# EAGLE design ADS1232 (EAGLE 9.5.2)
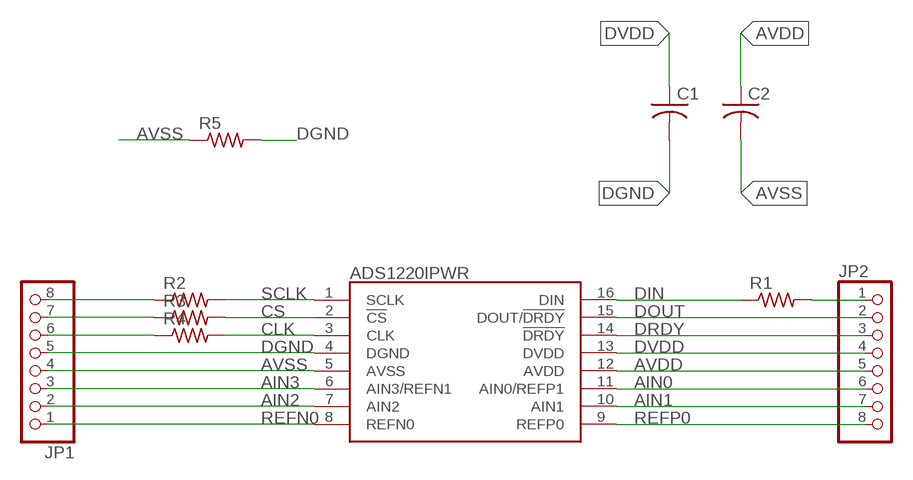
[diagram p0: schematic, sheet 1]

## Parts
C1  C-USC0805K  [C0805K]
C2  C-USC0805K  [C0805K]
IC1  ADS1220IPWR  [SOP65P640X120-16N]
JP1  PINHD-1X8  [1X08]
JP2  PINHD-1X8  [1X08]
R1  R-US_M2012  [M2012]
R2  R-US_M2012  [M2012]
R3  R-US_M2012  [M2012]
R4  R-US_M2012  [M2012]
R5  R-US_M2012  [M2012]

## Nets
AIN0: IC1.11(AIN0/REFP1) JP2.6
AIN1: IC1.10(AIN1) JP2.7
AIN2: IC1.7(AIN2) JP1.2
AIN3: IC1.6(AIN3/REFN1) JP1.3
AVDD: C2.1 IC1.12(AVDD) JP2.5
AVSS: C2.2 IC1.5(AVSS) JP1.4 R5.1
CLK: IC1.3(CLK) R4.2
CS: IC1.2(!CS) R3.2
DGND: C1.2 IC1.4(DGND) JP1.5 R5.2
DIN: IC1.16(DIN) R1.1
DOUT: IC1.15(DOUT/!DRDY) JP2.2
DRDY: IC1.14(!DRDY) JP2.3
DVDD: C1.1 IC1.13(DVDD) JP2.4
N$2: JP1.8 R2.1
N$3: JP1.7 R3.1
N$6: JP1.6 R4.1
N$20: JP2.1 R1.2
REFN0: IC1.8(REFN0) JP1.1
REFP0: IC1.9(REFP0) JP2.8
SCLK: IC1.1(SCLK) R2.2

## Library data of the parts
C1 C2 = adafruit:C-US: CAPACITOR, American symbol
IC1 = ADS1220IPWR:ADS1220IPWR: 24-bit, 2-kSPS, 4-ch, low-power, small-size delta-sigma ADC w/ PGA, VREF, 2x IDACs & SPI interface Source: Datasheet <https://www.ti.com/lit/gpn/ADS1220>; DESCRIPTION: 24-bit, 2-kSPS, 4-ch, low-power, small-size delta-sigma ADC w/ PGA, VREF, 2x IDACs & SPI interface; HEIGHT: 1.2mm; MANUFACTURER_NAME: Texas Instruments; MANUFACTURER_PART_NUMBER: ADS1220IPWR; TEXAS_INSTRUMENTS_PART_NUMBER: ADS1220IPWR; TEXAS_INSTRUMENTS_PRICE-STOCK: https://www.ti.com/store/ti/en/p/product/?p=ADS1220IPWR
JP1 JP2 = pinhead:PINHD-1X8: PIN HEADER
R1-R5 = adafruit:R-US_: RESISTOR, American symbol

## Board
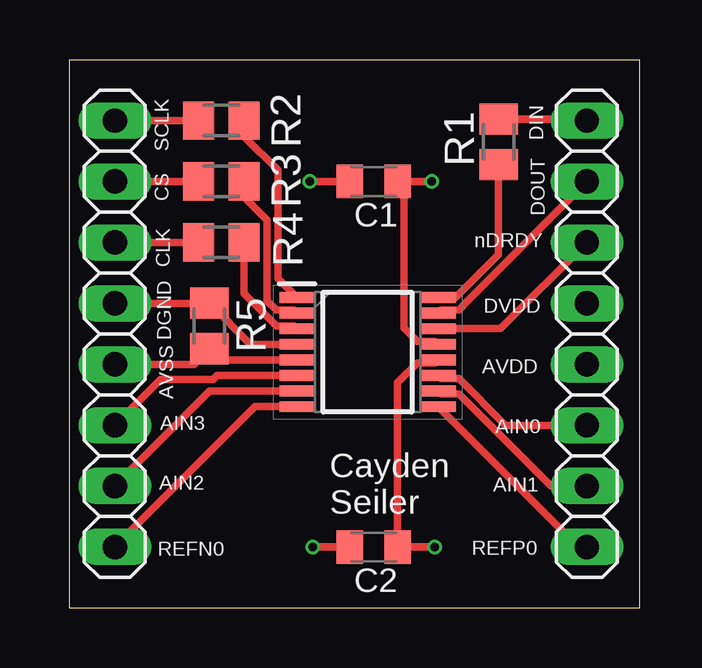
[diagram p1: board, top side]
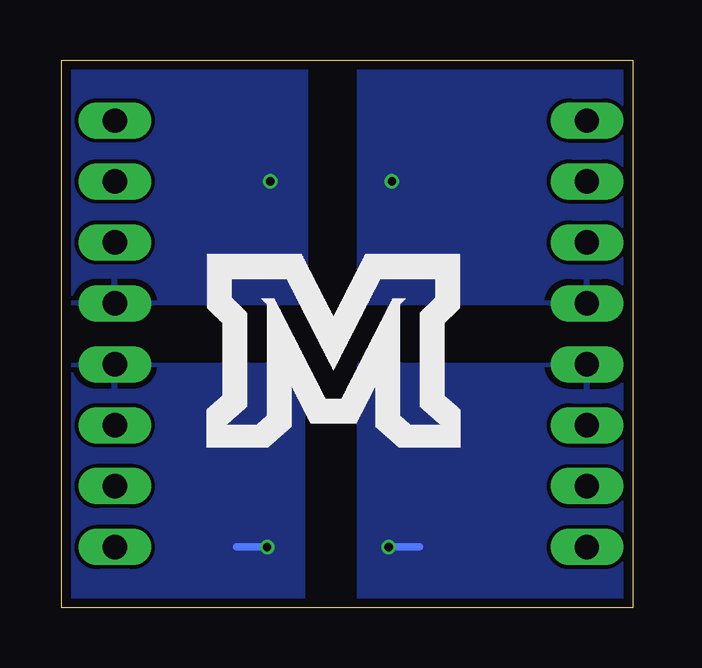
[diagram p2: board, bottom side, seen from below]

Size 23.8 x 22.85 mm. Coordinates in mm from the lower left corner, seen from the top.
Outline: 0,0 23.8,0 23.8,22.85 0,22.85 0,0
Copper layers (1*16): Top 0.035559375mm / dielectric 1.6mm / Bottom 0.035559375mm
Design rules "oshpark2layer": minimum track width 6mil, minimum drill 10mil, track to track 6mil, track to pad 6mil, pad to pad 6mil, via to via 6mil, smd to smd 6mil, copper to edge 15mil, drill to drill 6mil, minimum pad ring 5mil, minimum via ring 5mil, stop-mask expansion 2.5mil, vias tented up to drill 0mil, thermal gap 10mil

### Footprints (pad centres in the part's own frame; a part is rotated, then mirrored left to right if it is on the bottom)
C0805K = smd 1.1 x 1.4: 1 -1,0; 2 1,0
SOP65P640X120-16N = smd 1.475 x 0.45: 1 -2.938,2.275; 2 -2.938,1.625; 3 -2.938,0.975; 4 -2.938,0.325; 5 -2.938,-0.325; 6 -2.938,-0.975; 7 -2.938,-1.625; 8 -2.938,-2.275; 9 2.938,-2.275; 10 2.938,-1.625; 11 2.938,-0.975; 12 2.938,-0.325; 13 2.938,0.325; 14 2.938,0.975; 15 2.938,1.625; 16 2.938,2.275
1X08 = drill 1.016 long: 1 -8.89,0; 2 -6.35,0; 3 -3.81,0; 4 -1.27,0; 5 1.27,0; 6 3.81,0; 7 6.35,0; 8 8.89,0
M2012 = smd 1.3 x 1.6: 1 -0.95,0; 2 0.95,0

### Placement (x,y rotation side)
C1  12.7,17.78 180 top
C2  12.7,2.54 180 top
IC1  12.45,10.67 0 top
JP1  1.91,11.43 90 top
JP2  21.59,11.43 270 top
R1  17.91,19.43 90 top
R2  6.35,20.32 0 top
R3  6.35,17.78 0 top
R4  6.35,15.24 0 top
R5  5.85,11.76 90 top

### Tracks (layer width: path | path; a pad name or v marks a point on that pad's centre or on a via)
AIN0
  Top 0.305: IC1.11 15.5,9.57 16.25,9.57 18.2,7.62 JP2.6
AIN1
  Top 0.305: IC1.10 15.5,8.92 16.25,8.92 20.09,5.08 JP2.7
AIN2
  Top 0.305: IC1.7 5.87,9.04 JP1.2
AIN3
  Top 0.305: IC1.6 6.17,9.69 6.01,9.53 3.81,9.53 JP1.3
AVDD  (via drill 0.35)
  Top 0.305: v15.24,2.54 C2.1 13.7,9.4 14.52,10.22 15.26,10.22 IC1.12
  Bottom 0.305: v15.24,2.54 16.51,2.54
  pour Bottom: 26.67,10.16 13.72,10.16 13.72,-0.13 26.54,-0.13 26.67,0
AVSS  (via drill 0.35)
  Top 0.305: JP1.4 5.21,10.16 R5.1 6.32,10.34 IC1.5 | v10.16,2.54 C2.2
  Bottom 0.305: v10.16,2.54 8.89,2.54
  pour Bottom: 0,10.16 11.43,10.16 11.43,0 0,0
CLK
  Top 0.305: IC1.3 9.39,11.76 8.64,11.76 7.3,13.11 R4.2
CS
  Top 0.305: IC1.2 9.39,12.41 8.64,12.41 8.26,12.8 8.26,16.17 7.3,17.12 R3.2
DGND  (via drill 0.35)
  Top 0.305: JP1.5 R5.2 7.57,10.99 IC1.4 | C1.2 v10.03,17.78
  pour Bottom: 0,12.7 11.43,12.7 11.43,22.86 0,22.86
DIN
  Top 0.305: IC1.16 16.11,12.94 17.91,14.74 R1.1
DOUT
  Top 0.305: IC1.15 15.5,12.41 16.25,12.41 16.43,12.59 16.43,12.62 JP2.2
DRDY
  Top 0.305: IC1.14 17.99,11.64 JP2.3
DVDD  (via drill 0.35)
  Top 0.305: v15.11,17.78 13.97,17.78 | 13.97,17.78 C1.1 | IC1.13 15.26,11.11 14.52,11.11 13.97,11.66 13.97,17.78
  pour Bottom: 26.67,12.7 13.59,12.7 13.59,22.86 26.67,22.86
N$2
  Top 0.305: R2.1 JP1.8
N$3
  Top 0.305: R3.1 JP1.7
N$6
  Top 0.305: R4.1 JP1.6
N$20
  Top 0.305: R1.2 21.53,20.38 JP2.1
REFN0
  Top 0.305: IC1.8 7.76,8.39 JP1.1
REFP0
  Top 0.305: IC1.9 21.24,2.54 JP2.8
SCLK
  Top 0.305: IC1.1 8.71,13.74 8.71,18.25 7.3,19.66 R2.2

### Text on the board
tNames: SCLK | DIN | DOUT | CS | CLK | nDRDY | DGND | DVDD | AVSS | AVDD | AIN0 | AIN3 | AIN2 | AIN1 | Cayden / Seiler | REFP0 | REFN0
bNames: C:/Users/cayde/Pictures/M_Logo_Final256.bmp | C:/Users/cayde/Pictures/M_Logo_Final256.bmp
201bmp: C:/Users/cayde/Pictures/M_Logo_Final256.bmp